# Altium project IrrigationStation_V1R1.PrjPcb
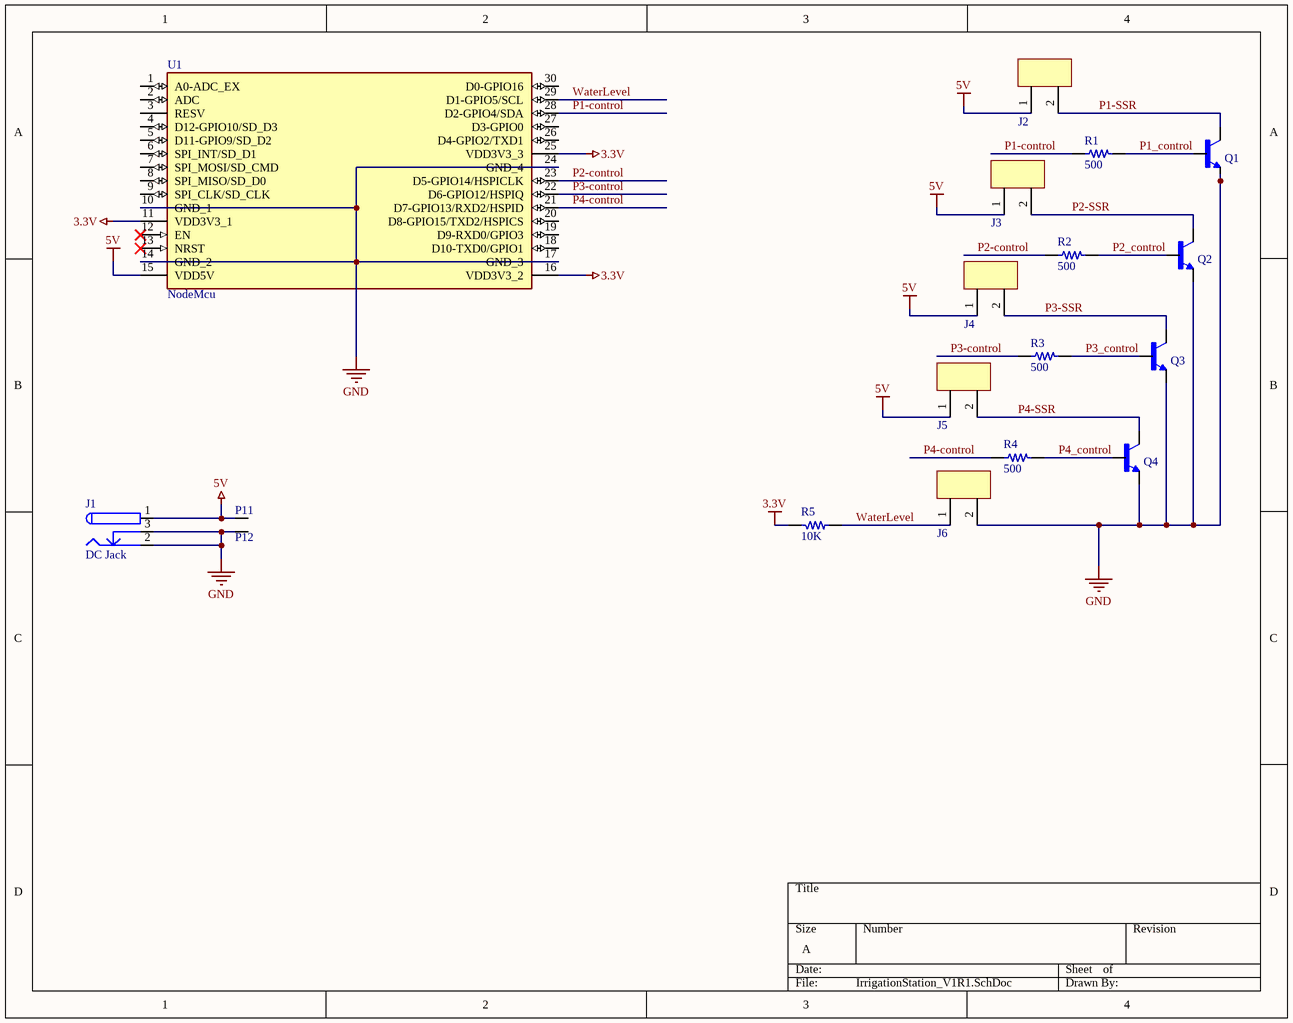
[diagram p0: IrrigationStation_V1R1.SchDoc]
1 sheet, 18 parts. Net scope: global (net labels, ports and power ports of the same name join across sheets).
Board file: IrrigationStation_V1R1.PcbDoc

## Sheet IrrigationStation_V1R1.SchDoc
size A

### Parts
J1  DC Jack  [DC Jack - KLDHCX]
J2  P1  [Terminal Block,2 Pos, 4mm]  (value not drawn)
J3  P2  [Terminal Block,2 Pos, 4mm]  (value not drawn)
J4  P3  [Terminal Block,2 Pos, 4mm]  (value not drawn)
J5  P4  [Terminal Block,2 Pos, 4mm]  (value not drawn)
J6  Water Level  [Terminal Block,2 Pos, 4mm]  (value not drawn)
P11  5V  [Pin - TH 1.5mm]  (value not drawn)
P12  GND  [Pin - TH 1.5mm]  (value not drawn)
Q1  P2N2222A  [TO92]  (value not drawn)
Q2  P2N2222A  [TO92]  (value not drawn)
Q3  P2N2222A  [TO92]  (value not drawn)
Q4  P2N2222A  [TO92]  (value not drawn)
R1  500  [Resistor - TH - 12mm]
R2  500  [Resistor - TH - 12mm]
R3  500  [Resistor - TH - 12mm]
R4  500  [Resistor - TH - 12mm]
R5  10K  [Resistor - TH - 12mm]
U1  NodeMcu  [DIP2286W64P254L4826H735Q30N]

### Nets
3.3V: R5.2 U1.11(VDD3V3_1) U1.16(VDD3V3_2) U1.25(VDD3V3_3)
5V: J1.1 J2.1 J3.1 J4.1 J5.1 P11.1 U1.15(VDD5V)
GND: J1.2 J1.3 J6.2 P12.1 Q1.1(E) Q2.1(E) Q3.1(E) Q4.1(E) U1.10(GND_1) U1.14(GND_2) U1.17(GND_3) U1.24(GND_4)
P1-control: R1.1 U1.28(D2-GPIO4/SDA)
P1-SSR: J2.2 Q1.3(C)
P1_control: Q1.2(B) R1.2
P2-control: R2.1 U1.23(D5-GPIO14/HSPICLK)
P2-SSR: J3.2 Q2.3(C)
P2_control: Q2.2(B) R2.2
P3-control: R3.1 U1.22(D6-GPIO12/HSPIQ)
P3-SSR: J4.2 Q3.3(C)
P3_control: Q3.2(B) R3.2
P4-control: R4.1 U1.21(D7-GPIO13/RXD2/HSPID)
P4-SSR: J5.2 Q4.3(C)
P4_control: Q4.2(B) R4.2
WaterLevel: J6.1 R5.1 U1.29(D1-GPIO5/SCL)

Not connected (* = marked no-connect by the designer): U1 1(A0-ADC_EX) 2(ADC) 3(RESV) 4(D12-GPIO10/SD_D3) 5(D11-GPIO9/SD_D2) 6(SPI_INT/SD_D1) 7(SPI_MOSI/SD_CMD) 8(SPI_MISO/SD_D0) 9(SPI_CLK/SD_CLK) 12(EN)* 13(NRST)* 18(D10-TXD0/GPIO1) 19(D9-RXD0/GPIO3) 20(D8-GPIO15/TXD2/HSPICS) 26(D4-GPIO2/TXD1) 27(D3-GPIO0) 30(D0-GPIO16)

### Library data of the parts
J1 = DC Jack: Manufacturer: Kycon; Manufacturer Part Number: KLDHCX-0202-AC-1; Supplier 1: Mouser; Stock 1: 495; Pricing 1: 1=1.01, 10=0.804, 100=0.769, 250=0.7, 500=0.629, 1000=0.56 (USD); Supplier Part Number 1: 806-KLDHCX-0202-AC-1
J2-J6 = TERM BLOCK PLUG 2POS: 2 Position Terminal Block Plug, Female Sockets 180° Free Hanging (In-Line)
P11 P12 = Pin: Single Pin
Q1-Q4 = P2N2222A: Transitor lÆ°á»¡ng cá»±c _BJT_ NPN 40V 600mA 300 MHz 625mW qua lá»— TO-92-3; MF: ON Semiconductor; SnapEDA_Link: https://www.snapeda.com/parts/P2N2222A/ON%20Semiconductor/view-part/13920/?ref=snap; Availability: Unavailable; MP: P2N2222A; Price: None; Value: *; Package: TO-92 ON Semiconductor
R1-R5 = Resistor: Generic Resistor
U1 = NodeMcu: Undefined or Miscellaneous; Manufacturer_Name: Seeed Studio; Manufacturer_Part_Number: 113990105; Datasheet Link: https://github.com/nodemcu/nodemcu-devkit-v1.0/blob/master/NODEMCU_DEVKIT_V1.0.PDF; Height: 7.35mm; Arrow Part Number: 113990105; Arrow Price/Stock: https://www.arrow.com/en/products/113990105/seeed-technology-limited; Mouser Part Number: 713-113990105; Mouser Price/Stock: https://www.mouser.co.uk/ProductDetail/Seeed-Studio/113990105?qs=SElPoaY2y5KMx8k1roAIKw%3D%3D